# EAGLE design muon_detector (EAGLE 5.09)
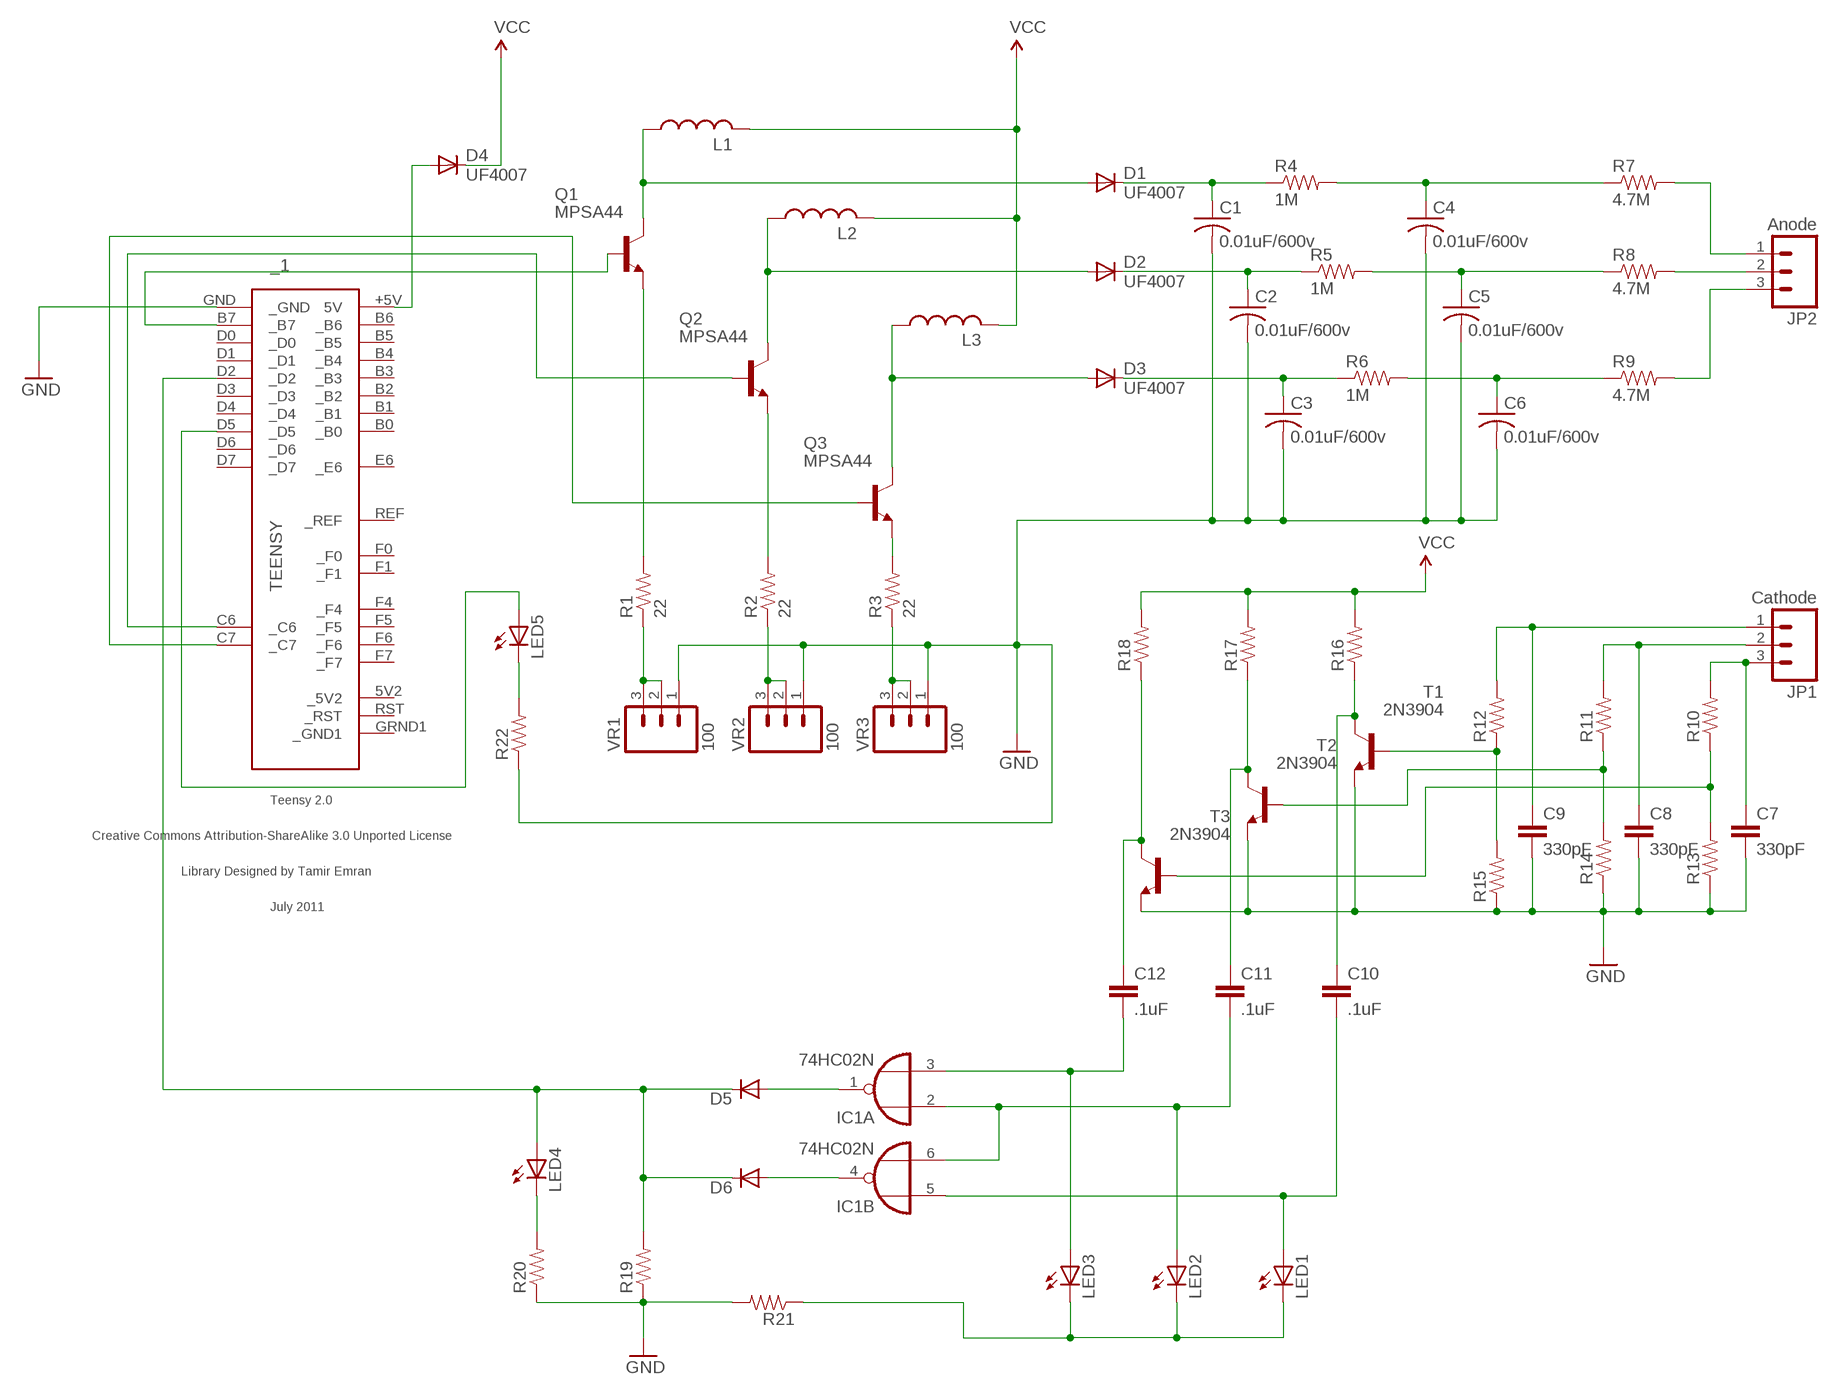
[diagram p0: schematic, sheet 1]

## Parts
_1  TEENSY  [TEENSY]
C1  0.01uF/600v  C-US075-032X103  [C075-032X103]
C2  0.01uF/600v  C-US075-032X103  [C075-032X103]
C3  0.01uF/600v  C-US075-032X103  [C075-032X103]
C4  0.01uF/600v  C-US075-032X103  [C075-032X103]
C5  0.01uF/600v  C-US075-032X103  [C075-032X103]
C6  0.01uF/600v  C-US075-032X103  [C075-032X103]
C7  330pF  CAPPTH1  [CAP-PTH-5MM]
C8  330pF  CAPPTH1  [CAP-PTH-5MM]
C9  330pF  CAPPTH1  [CAP-PTH-5MM]
C10  .1uF  CAPPTH1  [CAP-PTH-5MM]
C11  .1uF  CAPPTH1  [CAP-PTH-5MM]
C12  .1uF  CAPPTH1  [CAP-PTH-5MM]
D1  UF4007  UF4003  [DO41-10]
D2  UF4007  UF4003  [DO41-10]
D3  UF4007  UF4003  [DO41-10]
D4  UF4007  UF4003  [DO41-10]
D5  DIODE1N4148  [DIODE-1N4148]
D6  DIODE1N4148  [DIODE-1N4148]
IC1  74HC02N  [DIL14]
JP1  Cathode  M03LONGPADS  [1X03_LONGPADS]
JP2  Anode  M03LONGPADS  [1X03_LONGPADS]
L1  L-US0207/15  [0207/15]
L2  L-US0207/15  [0207/15]
L3  L-US0207/15  [0207/15]
LED1  LED5MM  [LED5MM]
LED2  LED5MM  [LED5MM]
LED3  LED5MM  [LED5MM]
LED4  LED5MM  [LED5MM]
LED5  LED5MM  [LED5MM]
Q1  MPSA44  2N3904  [TO92]
Q2  MPSA44  2N3904  [TO92]
Q3  MPSA44  2N3904  [TO92]
R1  22  RESISTORAXIAL-0.3  [AXIAL-0.3]
R2  22  RESISTORAXIAL-0.3  [AXIAL-0.3]
R3  22  RESISTORAXIAL-0.3  [AXIAL-0.3]
R4  1M  RESISTORAXIAL-0.3  [AXIAL-0.3]
R5  1M  RESISTORAXIAL-0.3  [AXIAL-0.3]
R6  1M  RESISTORAXIAL-0.3  [AXIAL-0.3]
R7  4.7M  RESISTORAXIAL-0.3  [AXIAL-0.3]
R8  4.7M  RESISTORAXIAL-0.3  [AXIAL-0.3]
R9  4.7M  RESISTORAXIAL-0.3  [AXIAL-0.3]
R10  RESISTORAXIAL-0.3  [AXIAL-0.3]
R11  RESISTORAXIAL-0.3  [AXIAL-0.3]
R12  RESISTORAXIAL-0.3  [AXIAL-0.3]
R13  RESISTORAXIAL-0.3  [AXIAL-0.3]
R14  RESISTORAXIAL-0.3  [AXIAL-0.3]
R15  RESISTORAXIAL-0.3  [AXIAL-0.3]
R16  RESISTORAXIAL-0.3  [AXIAL-0.3]
R17  RESISTORAXIAL-0.3  [AXIAL-0.3]
R18  RESISTORAXIAL-0.3  [AXIAL-0.3]
R19  RESISTORAXIAL-0.3  [AXIAL-0.3]
R20  RESISTORAXIAL-0.3  [AXIAL-0.3]
R21  RESISTORAXIAL-0.3  [AXIAL-0.3]
R22  RESISTORAXIAL-0.3  [AXIAL-0.3]
T1  2N3904  [TO92]
T2  2N3904  [TO92]
T3  2N3904  [TO92]
VR1  100  M03JST-PTH  [JST-3-PTH]
VR2  100  M03JST-PTH  [JST-3-PTH]
VR3  100  M03JST-PTH  [JST-3-PTH]

## Nets
GND: _1.GND(_GND) C1.2 C2.2 C3.2 C4.2 C5.2 C6.2 C7.2 C8.2 C9.2 R13.P$1 R14.P$1 R15.P$1 R19.P$1 R20.P$1 R21.P$2 R22.P$1 T1.3(E) T2.3(E) T3.3(E) VR1.1 VR2.1 VR3.1
N$1: _1.C6(_C6) Q2.2(B)
N$2: _1.C7(_C7) Q3.2(B)
N$3: _1.B7(_B7) Q1.2(B)
N$4: Q1.3(E) R1.P$2
N$5: R1.P$1 VR1.2 VR1.3
N$6: Q2.3(E) R2.P$2
N$7: R2.P$1 VR2.2 VR2.3
N$8: Q3.3(E) R3.P$2
N$9: R3.P$1 VR3.2 VR3.3
N$10: D1.A L1.1 Q1.1(C)
N$11: D2.A L2.1 Q2.1(C)
N$12: D3.A L3.1 Q3.1(C)
N$13: C1.1 D1.C R4.P$1
N$14: C2.1 D2.C R5.P$1
N$15: C3.1 D3.C R6.P$1
N$16: C4.1 R4.P$2 R7.P$1
N$17: C5.1 R5.P$2 R8.P$1
N$18: C6.1 R6.P$2 R9.P$1
N$19: JP2.1 R7.P$2
N$20: JP2.2 R8.P$2
N$21: JP2.3 R9.P$2
N$22: C9.1 JP1.1 R12.P$2
N$23: _1.+5V(5V) D4.A
N$24: C8.1 JP1.2 R11.P$2
N$25: C7.1 JP1.3 R10.P$2
N$26: C11.2 IC1.2(A:I0) IC1.6(B:I1) LED2.A
N$27: R12.P$1 R15.P$2 T1.2(B)
N$28: R11.P$1 R14.P$2 T2.2(B)
N$29: R10.P$1 R13.P$2 T3.2(B)
N$30: C10.2 IC1.5(B:I0) LED1.A
N$31: D5.A IC1.1(A:O)
N$32: C10.1 R16.P$1 T1.1(C)
N$33: C11.1 R17.P$1 T2.1(C)
N$34: C12.1 R18.P$1 T3.1(C)
N$35: D6.A IC1.4(B:O)
N$36: LED1.K(C) LED2.K(C) LED3.K(C) R21.P$1
N$37: LED4.K(C) R20.P$2
N$38: _1.D2(_D2) D5.C D6.C LED4.A R19.P$2
N$39: C12.2 IC1.3(A:I1) LED3.A
N$41: _1.D5(_D5) LED5.A
N$42: LED5.K(C) R22.P$2
VCC: D4.C L1.2 L2.2 L3.2 R16.P$2 R17.P$2 R18.P$2
Unconnected: _1.5V2(_5V2) _1.B0(_B0) _1.B1(_B1) _1.B2(_B2) _1.B3(_B3) _1.B4(_B4) _1.B5(_B5) _1.B6(_B6) _1.D0(_D0) _1.D1(_D1) _1.D3(_D3) _1.D4(_D4) _1.D6(_D6) _1.D7(_D7) _1.E6(_E6) _1.F0(_F0) _1.F1(_F1) _1.F4(_F4) _1.F5(_F5) _1.F6(_F6) _1.F7(_F7) _1.GRND1(_GND1) _1.REF(_REF) _1.RST(_RST) IC1.8(C:I0) IC1.9(C:I1) IC1.10(C:O) IC1.11(D:I0) IC1.12(D:I1) IC1.13(D:O)

## Power pins joined to a net without a drawn wire
GND: IC1.7(P:GND)
VCC: IC1.14(P:VCC)

## Library data of the parts
_1 = teensy:TEENSY: Teensy 2.0 Original Design by Clint Fisher Modified Design by Tamir Emran Licensed Under Creative Commons Attribution-ShareAlike 3.0 Unported (CC BY-SA 3.0)
C1-C6 = rcl:C-US: CAPACITOR, American symbol
C7-C12 = SparkFun:CAP: Capacitor Standard 0603 ceramic capacitor, and 0.1" leaded capacitor.
D1-D4 = diode:UF4003: DIODE ultrafast recovery diode, 200 V rectifier
D5 D6 = SparkFun:DIODE: Diode These are standard reverse protection diodes and small signal diodes. SMA package can handle up to about 1A. SOD-323 can handle about 200mA. What the SOD-323 package when ordering, there are some mfgs out there that are 5-pin packages.
IC1 = 74xx-eu:74*02: Quad 2-input NOR gate
JP1 JP2 VR1-VR3 = SparkFun:M03: Header 3 Standard 3-pin 0.1" header. Use with straight break away headers (SKU : PRT-00116), right angle break away headers (PRT-00553), swiss pins (PRT-00743), machine pins (PRT-00117), and female headers (PRT-00115). Molex polarized connector foot print use with SKU : PRT-08232 with associated crimp pins and housings.
L1-L3 = resistor:L-US: INDUCTOR, American symbol
LED1-LED5 = led:LED: LED OSRAM: - CHIPLED LG R971, LG N971, LY N971, LG Q971, LY Q971, LO R971, LY R971 LH N974, LH R974 LS Q976, LO Q976, LY Q976 LO Q996 - Hyper CHIPLED LW Q18S LB Q993, LB Q99A, LB R99A - SideLED LS A670, LO A670, LY A670, LG A670, LP A670 LB A673, LV A673, LT A673, LW A673 LH A674 LY A675 LS A676, LA A676, LO A676, LY A676, LW A676 LS A679, LY A679, LG A679 - Hyper Micro SIDELED® LS Y876, LA Y876, LO Y876, LY Y876 LT Y87S - SmartLED LW L88C, LW L88S LB L89C, LB L89S, LG L890 LS L89K, LO L89K, LY L89K LS L896, LA L896, LO L896, LY L896 - TOPLED LS T670, LO T670, LY T670, LG T670, LP T670 LSG T670, LSP T670, LSY T670, LOP T670, LYG T670 LG T671, LOG T671, LSG T671 LB T673, LV T673, LT T673, LW T673 LH T674 LS T676, LA T676, LO T676, LY T676, LB T676, LH T676, LSB T676, LW T676 LB T67C, LV T67C, LT T67C, LS T67K, LO T67K, LY T67K, LW E67C LS E67B, LA E67B, LO E67B, LY E67B, LB E67C, LV E67C, LT E67C LW T67C LS T679, LY T679, LG T679 LS T770, LO T770, LY T770, LG T770, LP T770 LB T773, LV T773, LT T773, LW T773 LH T774 LS E675, LA E675, LY E675, LS T675 LS T776, LA T776, LO T776, LY T776, LB T776 LHGB T686 LT T68C, LB T68C - Hyper Mini TOPLED® LB M676 - Mini TOPLED Santana® LG M470 LS M47K, LO M47K, LY M47K Source: http://www.osram.convergy.de LUXEON: - LUMILED® LXK2-PW12-R00, LXK2-PW12-S00, LXK2-PW14-U00, LXK2-PW14-V00 LXK2-PM12-R00, LXK2-PM12-S00, LXK2-PM14-U00 LXK2-PE12-Q00, LXK2-PE12-R00, LXK2-PE12-S00, LXK2-PE14-T00, LXK2-PE14-U00 LXK2-PB12-K00, LXK2-PB12-L00, LXK2-PB12-M00, LXK2-PB14-N00, LXK2-PB14-P00, LXK2-PB14-Q00 LXK2-PR12-L00, LXK2-PR12-M00, LXK2-PR14-Q00, LXK2-PR14-R00 LXK2-PD12-Q00, LXK2-PD12-R00, LXK2-PD12-S00 LXK2-PH12-R00, LXK2-PH12-S00 LXK2-PL12-P00, LXK2-PL12-Q00, LXK2-PL12-R00 Source: www.luxeon.com KINGBRIGHT: KA-3528ASYC Source: www.kingbright.com
Q1-Q3 T1-T3 = transistor:2N3904: NPN TRANSISTOR
R1-R22 = SparkFun:RESISTOR: Resistor Basic schematic elements and footprints for 0603, 1206, and PTH resistors.

## Net classes
0 default: width 0.508 mm, drill 0.508 mm, clearance 0.635 mm

## Board
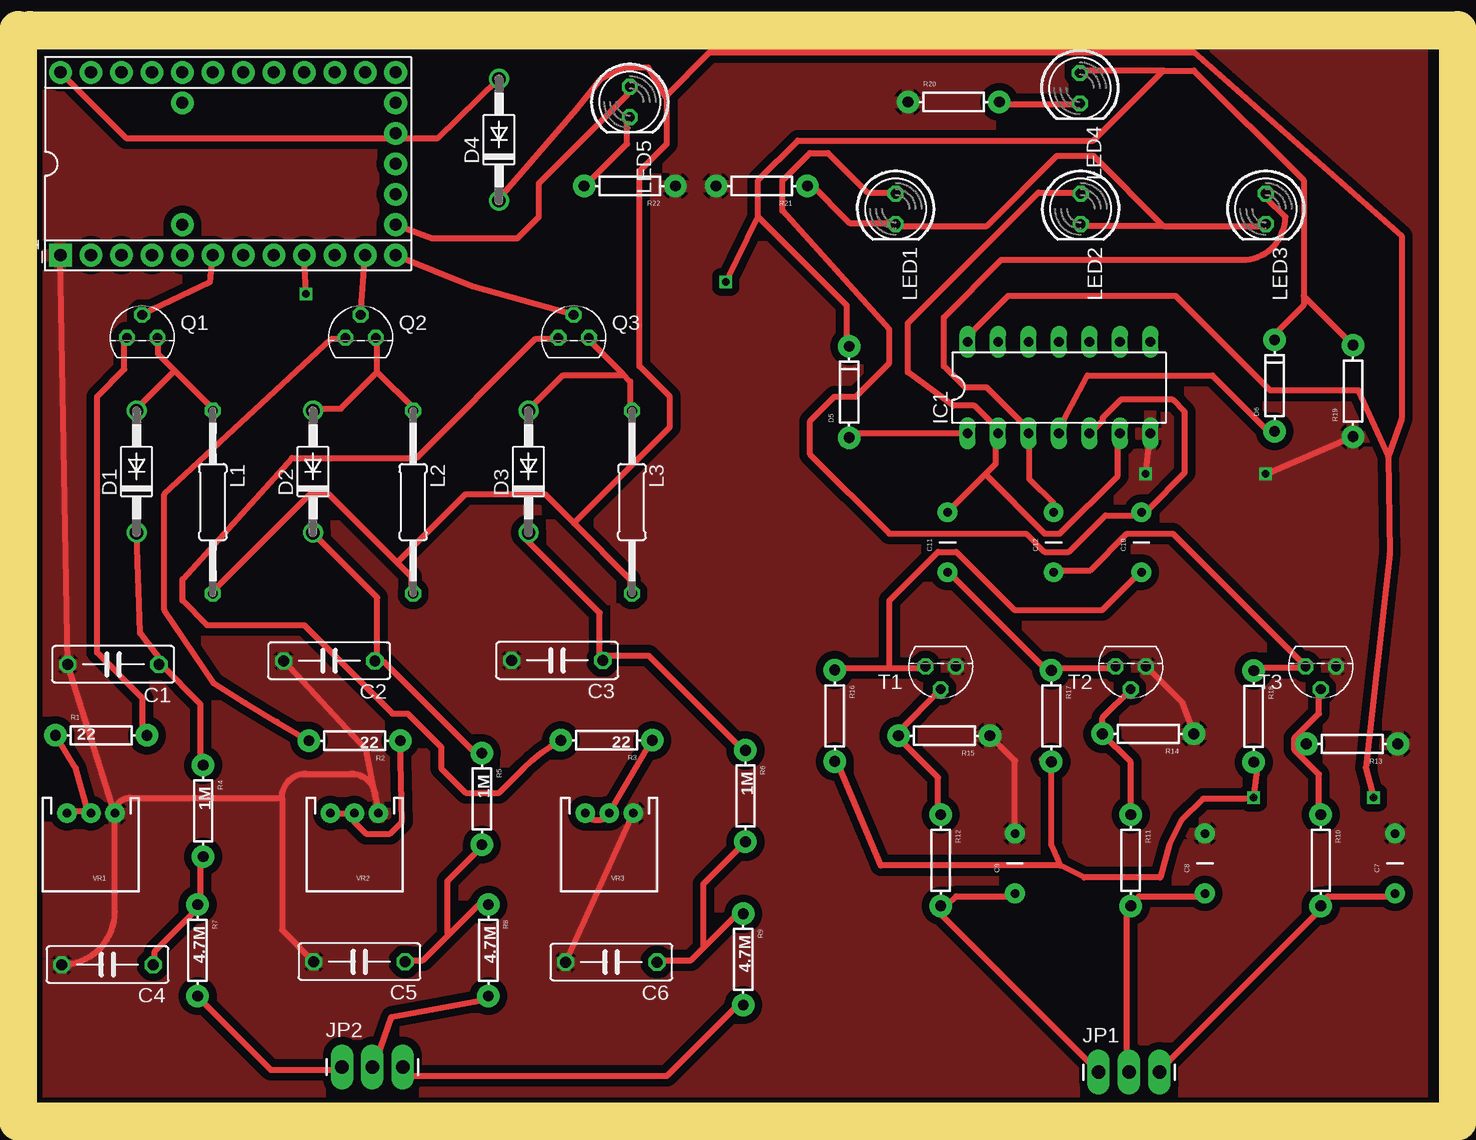
[diagram p1: board, top side]
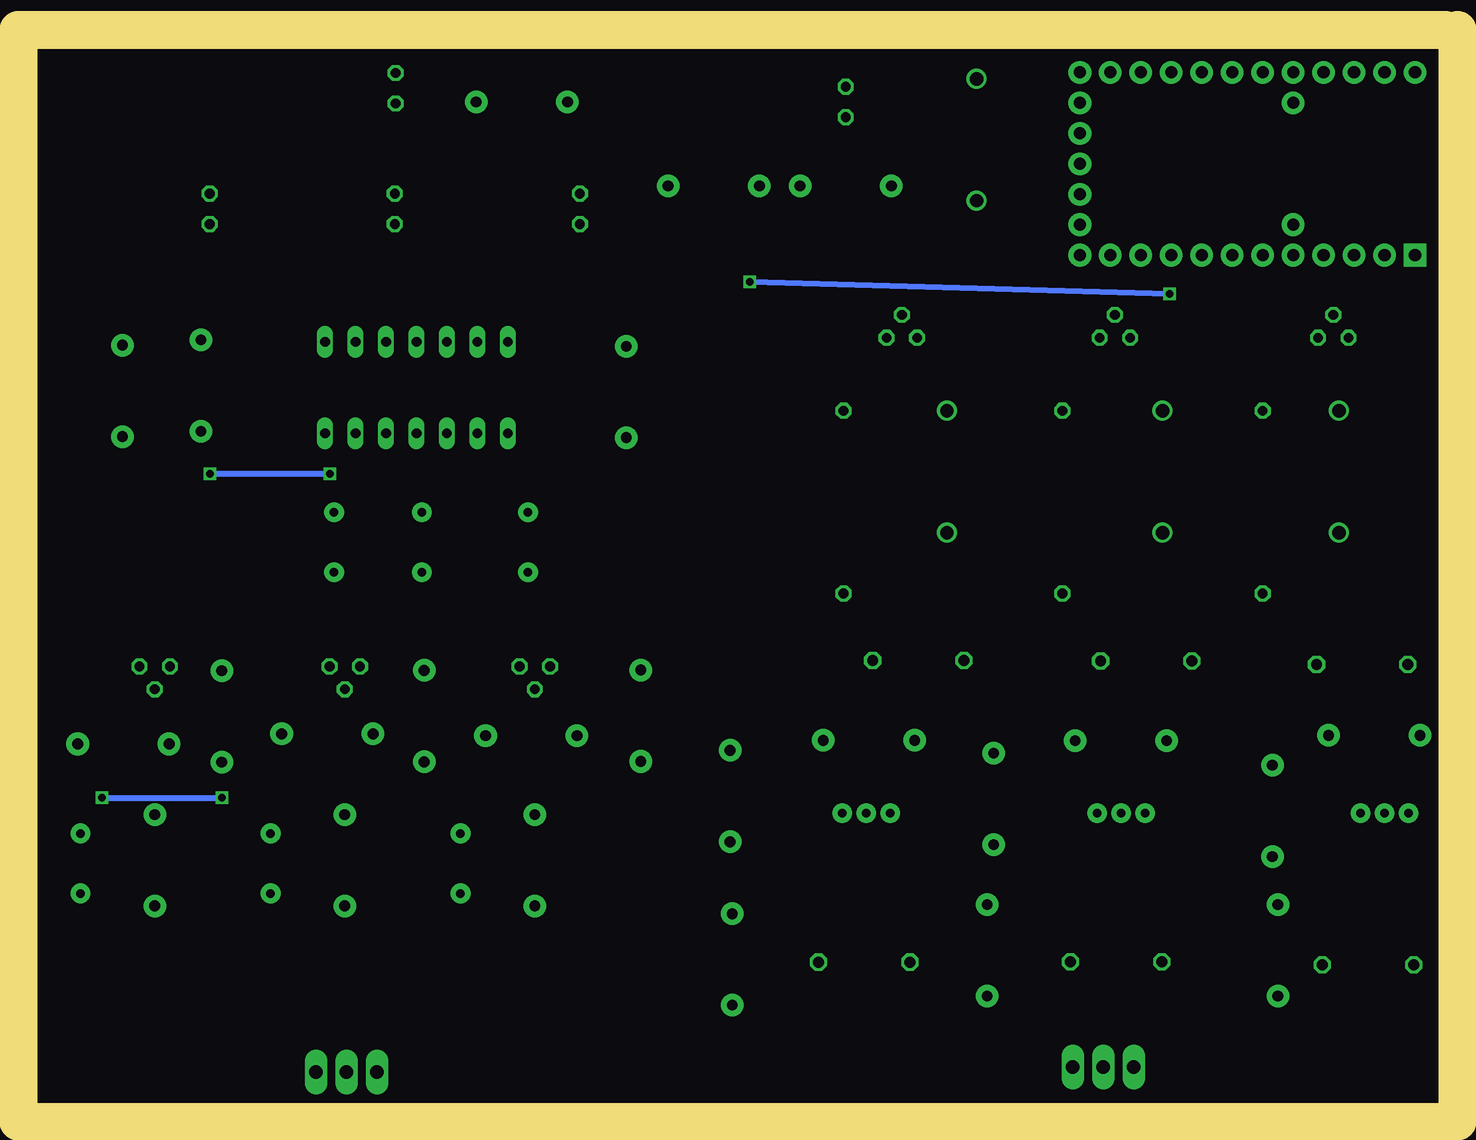
[diagram p2: board, bottom side, seen from below]

Size 118 x 90 mm. Coordinates in mm from the lower left corner, seen from the top.
Outline: 0,0 118,0 118,90 0,90 0,0
Copper layers (1*16): Top 0.035mm / dielectric 1.5mm / Bottom 0.035mm
Design rules "default *": minimum track width 8mil, minimum drill 24mil, track to track 20mil, track to pad 20mil, pad to pad 20mil, via to via 8mil, smd to smd 8mil, copper to edge 40mil, drill to drill 8mil, minimum pad ring 10mil, minimum via ring 8mil, stop-mask expansion 4mil, vias tented up to drill 0mil, thermal gap 10mil
Milling: 4 lines

### Footprints (pad centres in the part's own frame; a part is rotated, then mirrored left to right if it is on the bottom)
TEENSY = drill 1.016 pad 1.88 round: 5V2 13.97,-2.54; +5V -13.97,7.62; B0 -11.43,-7.62; B1 -8.89,-7.62; B2 -6.35,-7.62; B3 -3.81,-7.62; B4 8.89,7.62; B5 6.35,7.62; B6 3.81,7.62; B7 -1.27,-7.62; C6 11.43,-7.62; C7 13.97,-7.62; D0 1.27,-7.62; D1 3.81,-7.62; D2 6.35,-7.62; D3 8.89,-7.62; D4 13.97,5.08; D5 13.97,-5.08; D6 13.97,7.62; D7 11.43,7.62; E6 -3.81,-5.08; F0 -11.43,7.62; F1 -8.89,7.62; F4 -6.35,7.62; F5 -3.81,7.62; F6 -1.27,7.62; F7 1.27,7.62; GRND1 13.97,0; REF -3.81,5.08; RST 13.97,2.54 | drill 1.016 pad 1.88 square: GND -13.97,-7.62
C075-032X103 = drill 0.914 octagon: 1 -3.81,0; 2 3.81,0
CAP-PTH-5MM = drill 0.7 pad 1.651 round: 1 -2.5,0; 2 2.5,0
DO41-10 = drill 1.118 round: A 5.08,0; C -5.08,0
DIODE-1N4148 = drill 0.9 pad 1.88 round: A -3.81,0; C 3.81,0
DIL14 = drill 0.813 long: 1 -7.62,-3.81; 2 -5.08,-3.81; 3 -2.54,-3.81; 4 0,-3.81; 5 2.54,-3.81; 6 5.08,-3.81; 7 7.62,-3.81; 8 7.62,3.81; 9 5.08,3.81; 10 2.54,3.81; 11 0,3.81; 12 -2.54,3.81; 13 -5.08,3.81; 14 -7.62,3.81
1X03_LONGPADS = drill 1.118 pad 1.88 long: 1 0,0; 2 2.54,0; 3 5.08,0
0207/15 = drill 0.813 octagon: 1 -7.62,0; 2 7.62,0
LED5MM = drill 0.813 octagon: A -1.27,0; K 1.27,0
TO92 = drill 0.813 octagon: 1 1.27,0; 2 0,1.905; 3 -1.27,0
AXIAL-0.3 = drill 0.9 pad 1.88 round: P$1 -3.81,0; P$2 3.81,0
JST-3-PTH = drill 0.7 pad 1.626 round: 1 -2,-5; 2 0,-5; 3 2,-5

### Placement (x,y rotation side)
_1  16.51,78.85 0 top
C1  6.94,37.11 180 top
C2  24.94,37.41 180 top
C3  43.94,37.44 180 top
C4  6.46,12.08 180 top
C5  27.46,12.32 180 top
C6  48.46,12.29 180 top
C7  113.79,20.51 90 top
C8  97.95,20.51 90 top
C9  82.11,20.51 90 top
C10  92.65,47.29 90 top
C11  76.49,47.29 90 top
C12  85.33,47.29 90 top
D1  8.89,53.18 90 top
D2  23.59,53.18 90 top
D3  41.56,53.18 90 top
D4  39.1,80.85 90 top
D5  68.29,59.82 90 top
D6  103.75,60.36 90 top
IC1  85.78,60.18 0 top
JP1  89.08,3.11 0 top
JP2  26,3.55 0 top
L1  15.24,50.64 270 top
L2  31.94,50.64 270 top
L3  50.18,50.64 270 top
LED1  72.16,75.09 270 top
LED2  87.59,75.09 270 top
LED3  103.02,75.09 270 top
LED4  87.52,85.15 270 top
LED5  50,84 270 top
Q1  9.35,64.34 0 top
Q2  27.56,64.34 0 top
Q3  45.32,64.34 0 top
R1  5.94,31.19 0 top
R2  27.06,30.75 180 top
R3  48.06,30.78 180 top
R4  14.43,24.89 270 top
R5  37.67,25.89 270 top
R6  59.64,26.13 270 top
R7  13.97,13.27 270 top
R8  38.21,13.27 270 top
R9  59.45,12.51 270 top
R10  107.6,20.78 270 top
R11  91.76,20.78 270 top
R12  75.92,20.78 270 top
R13  110.21,30.48 180 top
R14  93.21,31.32 180 top
R15  76.21,31.16 180 top
R16  67.09,32.83 270 top
R17  85.14,32.8 270 top
R18  102.01,32.77 270 top
R19  110.29,59.91 90 top
R20  77,84 0 top
R21  61,77 180 top
R22  50,77 180 top
T1  75.92,36.94 180 top
T2  91.76,36.94 180 top
T3  107.6,36.94 180 top
VR1  5.08,19.7 180 top
VR2  27.05,19.7 180 top
VR3  48.29,19.7 180 top

### Tracks (layer width: path | path; a pad name or v marks a point on that pad's centre or on a via)
GND  (via drill 0.6)
  Top 0.508: C9.2 82.11,29.07 R15.P$1 | T2.3 93.06,36.94 96,34 R14.P$1 | C6.2 VR3.1 | C2.2 28,30 28.8,25.96 | 28.8,25.96 VR2.1 | C5.2 21,14.97 21,26 | 21,26 arc-90 23,28 26.76,28 arc-90 28.8,25.96 | 21,26 8.38,26 arc90 VR1.1 | VR1.1 7.08,16.51 arc-90 C4.2 | VR1.1 C1.2 _1.GND | v103,53 R19.P$1 | v93,53 IC1.7
  Bottom 0.508: v93,53 v103,53
  pour Top: 0,90 116,90 116,0 0,0
N$1
  Top 0.508: Q2.2 _1.C6
N$2
  Top 0.508: Q3.2 45.21,66.29 36.88,68.63 _1.C7
N$3
  Top 0.508: Q1.2 9.4,66.29 15,69 _1.B7
N$4
  Top 0.508: Q1.3 7.87,64.26 7.87,61.72 5.59,59.44 5.59,38.1 9.4,34.29 9.4,31.5 9.65,31.24 R1.P$2
N$5
  Top 0.508: 4.83,24.89 5.08,24.89 VR1.2 4.83,24.89 | 4.83,24.89 3.3,24.89 VR1.3 | 4.83,24.89 3.83,28.45 2.29,30.99 R1.P$1
N$6
  Top 0.508: Q2.3 26.16,64.26 25.15,64.26 11.19,51.31 11.19,41.66 15.3,35.54 arc2 R2.P$2
N$7
  Top 0.508: R2.P$1 31,24 30,23 28,23 27.05,23.95 VR2.2 VR2.3
N$8
  Top 0.508: Q3.3 43.94,64.26 42.16,64.26 32.23,54.32 21.84,54.32 12.72,44.2 12.72,42.42 14.75,40.39 22.86,40.39 30.23,33.02 31.5,33.02 34.29,30.23 34.29,28.45 36.32,26.42 39.12,26.42 41.15,28.45 arc-16 R3.P$2
N$9
  Top 0.508: R3.P$1 VR3.2 arc-119 VR3.3
N$10
  Top 0.508: 12.06,61.59 10.67,62.99 10.67,64.26 Q1.1 | 12.06,61.59 15.24,58.42 L1.1 | D1.A 8.89,58.42 12.06,61.59
N$11
  Top 0.508: 28.96,61.47 28.96,64.26 Q2.1 | 28.96,61.47 32,58.42 L2.1 | 28.96,61.47 25.91,58.42 23.62,58.42 D2.A
N$12
  Top 0.508: 49.4,61.34 46.48,64.26 Q3.1 | 49.4,61.34 50.04,60.71 50.04,58.42 L3.1 | D3.A 41.66,58.42 44.45,61.21 49.28,61.21 49.4,61.34
N$13
  Top 0.508: R4.P$1 14.22,28.7 14.22,33.78 10.92,37.08 C1.1 11.18,37.08 9.18,39.72 8.89,48.01 D1.C
N$14
  Top 0.508: R5.P$1 37.59,29.72 37.08,29.72 29.46,37.34 28.96,37.34 C2.1 28.96,37.59 28.96,42.67 23.62,48.01 D2.C
N$15
  Top 0.508: 47.5,37.85 47.5,41.4 41.4,47.5 41.4,48.01 D3.C | 47.5,37.85 47.5,37.59 C3.1 47.5,37.85 | 47.5,37.85 51.56,37.85 59.44,29.97 R6.P$1
N$16
  Top 0.508: C4.1 10.41,12.19 10.41,13.21 13.97,16.76 R7.P$1 13.97,17.27 14.22,17.53 14.22,20.83 R4.P$2
N$17
  Top 0.508: 34.92,14.61 37.34,17.02 38.1,17.02 R8.P$1 | 34.92,14.61 32.77,12.45 31.5,12.45 C5.1 | R5.P$2 37.59,21.84 34.8,19.05 34.8,14.73 34.92,14.61
N$18
  Top 0.508: 56.26,13.59 58.93,16.26 59.44,16.26 R9.P$1 | 56.26,13.59 55.12,12.45 52.32,12.45 C6.1 | R6.P$2 59.44,22.1 56.13,18.8 56.13,13.72 56.26,13.59
N$19
  Top 0.508: R7.P$2 13.97,9.4 20.07,3.3 25.4,3.3 25.91,2.79 JP2.1
N$20
  Top 0.508: JP2.2 28.7,2.79 28.7,3.56 30.14,7.71 37.85,9.14 38.1,9.4 R8.P$2
N$21
  Top 0.508: JP2.3 31.24,2.79 53.09,2.79 58.93,8.64 59.44,8.64 R9.P$2
N$22
  Top 0.508: C9.1 82.04,17.78 77.22,17.78 76.45,17.02 75.95,17.02 R12.P$2 75.95,16.76 75.95,16.26 88.9,3.3 JP1.1
N$23
  Top 0.508: _1.+5V 8,81 34,81 D4.A
N$24
  Top 0.508: C8.1 97.79,17.78 92.46,17.78 91.69,17.02 R11.P$2 91.44,17.02 91.44,3.3 JP1.2
N$25
  Top 0.508: C7.1 113.54,17.78 108.2,17.78 107.44,17.02 R10.P$2 107.7,16.76 94.23,3.3 JP1.3
N$26
  Top 0.508: 79.63,52.96 76.71,50.04 C11.2 | 79.63,52.96 80.52,53.85 80.52,56.13 IC1.2 80.52,56.39 80.52,56.9 78.74,58.67 76.96,58.67 73.17,61.47 73.17,65.55 84.07,76.45 87.38,76.45 LED2.A | IC1.6 90.68,56.13 90.68,52.83 85.85,48.01 84.58,48.01 79.63,52.96
N$27
  Top 0.508: T1.2 75.69,34.8 72.64,31.75 72.64,31.24 R15.P$2 72.39,30.99 75.69,27.69 75.69,24.64 R12.P$1
N$28
  Top 0.508: R11.P$1 91.76,28.96 R14.P$2 89.4,32.67 T2.2
N$29
  Top 0.508: 105.41,30.48 105.41,30.99 107.44,33.02 107.44,34.8 T3.2 | 105.41,30.48 105.41,29.97 107.44,27.94 107.44,24.64 R10.P$1 | 105.41,30.48 R13.P$2
N$30
  Top 0.508: IC1.5 88.39,56.39 89.41,57.4 89.41,57.66 90.93,59.18 95.25,59.18 96.27,58.17 96.27,53.09 93.22,50.04 92.71,50.04 C10.2 92.71,49.53 89.66,49.53 86.61,46.48 84.58,46.48 83.06,48.01 71.63,48.01 65.02,54.61 65.02,57.4 67.06,59.44 68.83,59.44 71.63,62.23 71.63,65.02 62.72,74.93 62.72,77.45 65.01,79.74 66.53,79.74 69.82,76.45 72.14,76.45 LED1.A
N$31
  Top 0.508: IC1.1 77.98,56.39 68.58,56.39 68.33,56.13 D5.A
N$32
  Top 0.508: 71.63,36.83 67.31,36.83 R16.P$1 | 71.63,36.83 74.42,36.83 T1.1 | 71.63,36.83 71.63,42.42 75.69,46.48 77.22,46.48 82.04,41.66 89.41,41.66 92.46,44.7 C10.1
N$33
  Top 0.508: T2.1 90.42,36.83 85.34,36.83 R17.P$1 85.09,36.83 84.58,36.83 76.71,44.7 C11.1
N$34
  Top 0.508: R18.P$1 102.11,36.83 106.17,36.83 T3.1 106.17,37.08 95.25,48.01 91.44,48.01 88.39,44.96 85.34,44.96 C12.1
N$35
  Top 0.508: IC1.4 85.85,56.39 85.85,56.9 88.15,61.2 98.57,61.2 103.12,56.64 103.63,56.64 D6.A
N$36
  Top 0.508: R21.P$1 65.02,77.22 68.33,73.91 72.14,73.91 LED1.K 72.39,73.66 79.76,73.66 85.6,79.5 88.65,79.5 94.49,73.66 | 94.49,73.66 102.87,73.66 LED3.K | 94.49,73.66 87.63,73.66 LED2.K
N$37
  Top 0.508: LED4.K 87.38,83.82 81.03,83.82 R20.P$2
N$38  (via drill 0.6)
  Top 0.508: 94.49,86.61 97.03,86.61 106.17,77.47 106.17,67.82 | 94.49,86.61 87.63,86.61 LED4.A | 106.17,67.82 106.17,67.06 103.89,64.77 103.89,64.26 D6.C | 60.71,74.42 68.07,67.06 68.07,63.75 D5.C | 60.71,74.42 60.71,77.47 64.01,80.77 88.65,80.77 94.49,86.61 | 106.17,67.82 110.24,63.75 R19.P$2 | v58,69 60.71,74.42 | v23,68 _1.D2
  Bottom 0.508: v23,68 v58,69
N$39
  Top 0.508: C12.2 85.34,50.04 85.34,50.55 83.31,52.58 83.31,56.13 IC1.3 83.06,56.39 83.06,56.9 79.76,60.2 77.96,60.2 76.18,61.98 76.18,66.04 80.98,70.83 101.06,70.83 arc90 104.65,74.42 103.12,75.95 103.12,76.2 LED3.A
N$41
  Top 0.508: LED5.A 49.78,85.09 49.78,84.58 42.42,77.22 42.42,74.42 40.64,72.64 33.53,72.64 _1.D5
N$42
  Top 0.508: LED5.K 49.78,82.55 49.78,80.52 46.23,76.96 R22.P$2
VCC  (via drill 0.6)
  Top 0.508: 30.61,45.59 31.75,44.45 31.75,43.18 L2.2 | 30.61,45.59 24.89,51.31 23.37,51.31 15.24,43.18 L1.2 | 45.34,48.9 42.93,51.31 36.32,51.31 30.61,45.59 | 45.34,48.9 50.04,44.2 50.04,43.18 L3.2 | 52.96,84.45 53.09,84.33 53.09,80.52 50.8,78.23 50.8,61.98 53.34,59.44 53.34,56.9 45.34,48.9 | 52.96,84.45 51.55,86.87 49.53,86.87 47.51,85.85 45.51,83.34 39.12,75.95 D4.C | 84.33,29.21 85.09,29.21 R17.P$2 85.14,22.08 85.88,20.34 | R16.P$2 67.31,28.96 70.93,20.34 85.88,20.34 | 113.22,54.47 113.35,46.34 111.35,28.48 v112,26 | 113.22,54.47 110.74,59.94 103.38,59.94 95.5,67.82 81.53,67.82 78.23,64.52 78.23,64.01 IC1.14 | R18.P$2 102.11,28.96 102.36,28.7 v102,26 101.35,25.91 97.77,25.91 96,24.13 95,22.11 94.22,19.34 87.88,19.34 85.88,20.34 | 52.96,84.45 56.64,88.14 97.03,88.14 114.35,72.82 114.35,57.59 113.22,54.47
  Bottom 0.508: v112,26 v102,26